# EAGLE design RTI-Dome-eth-ESP32 (EAGLE 9.6.2)

## Sheet 1 of 2
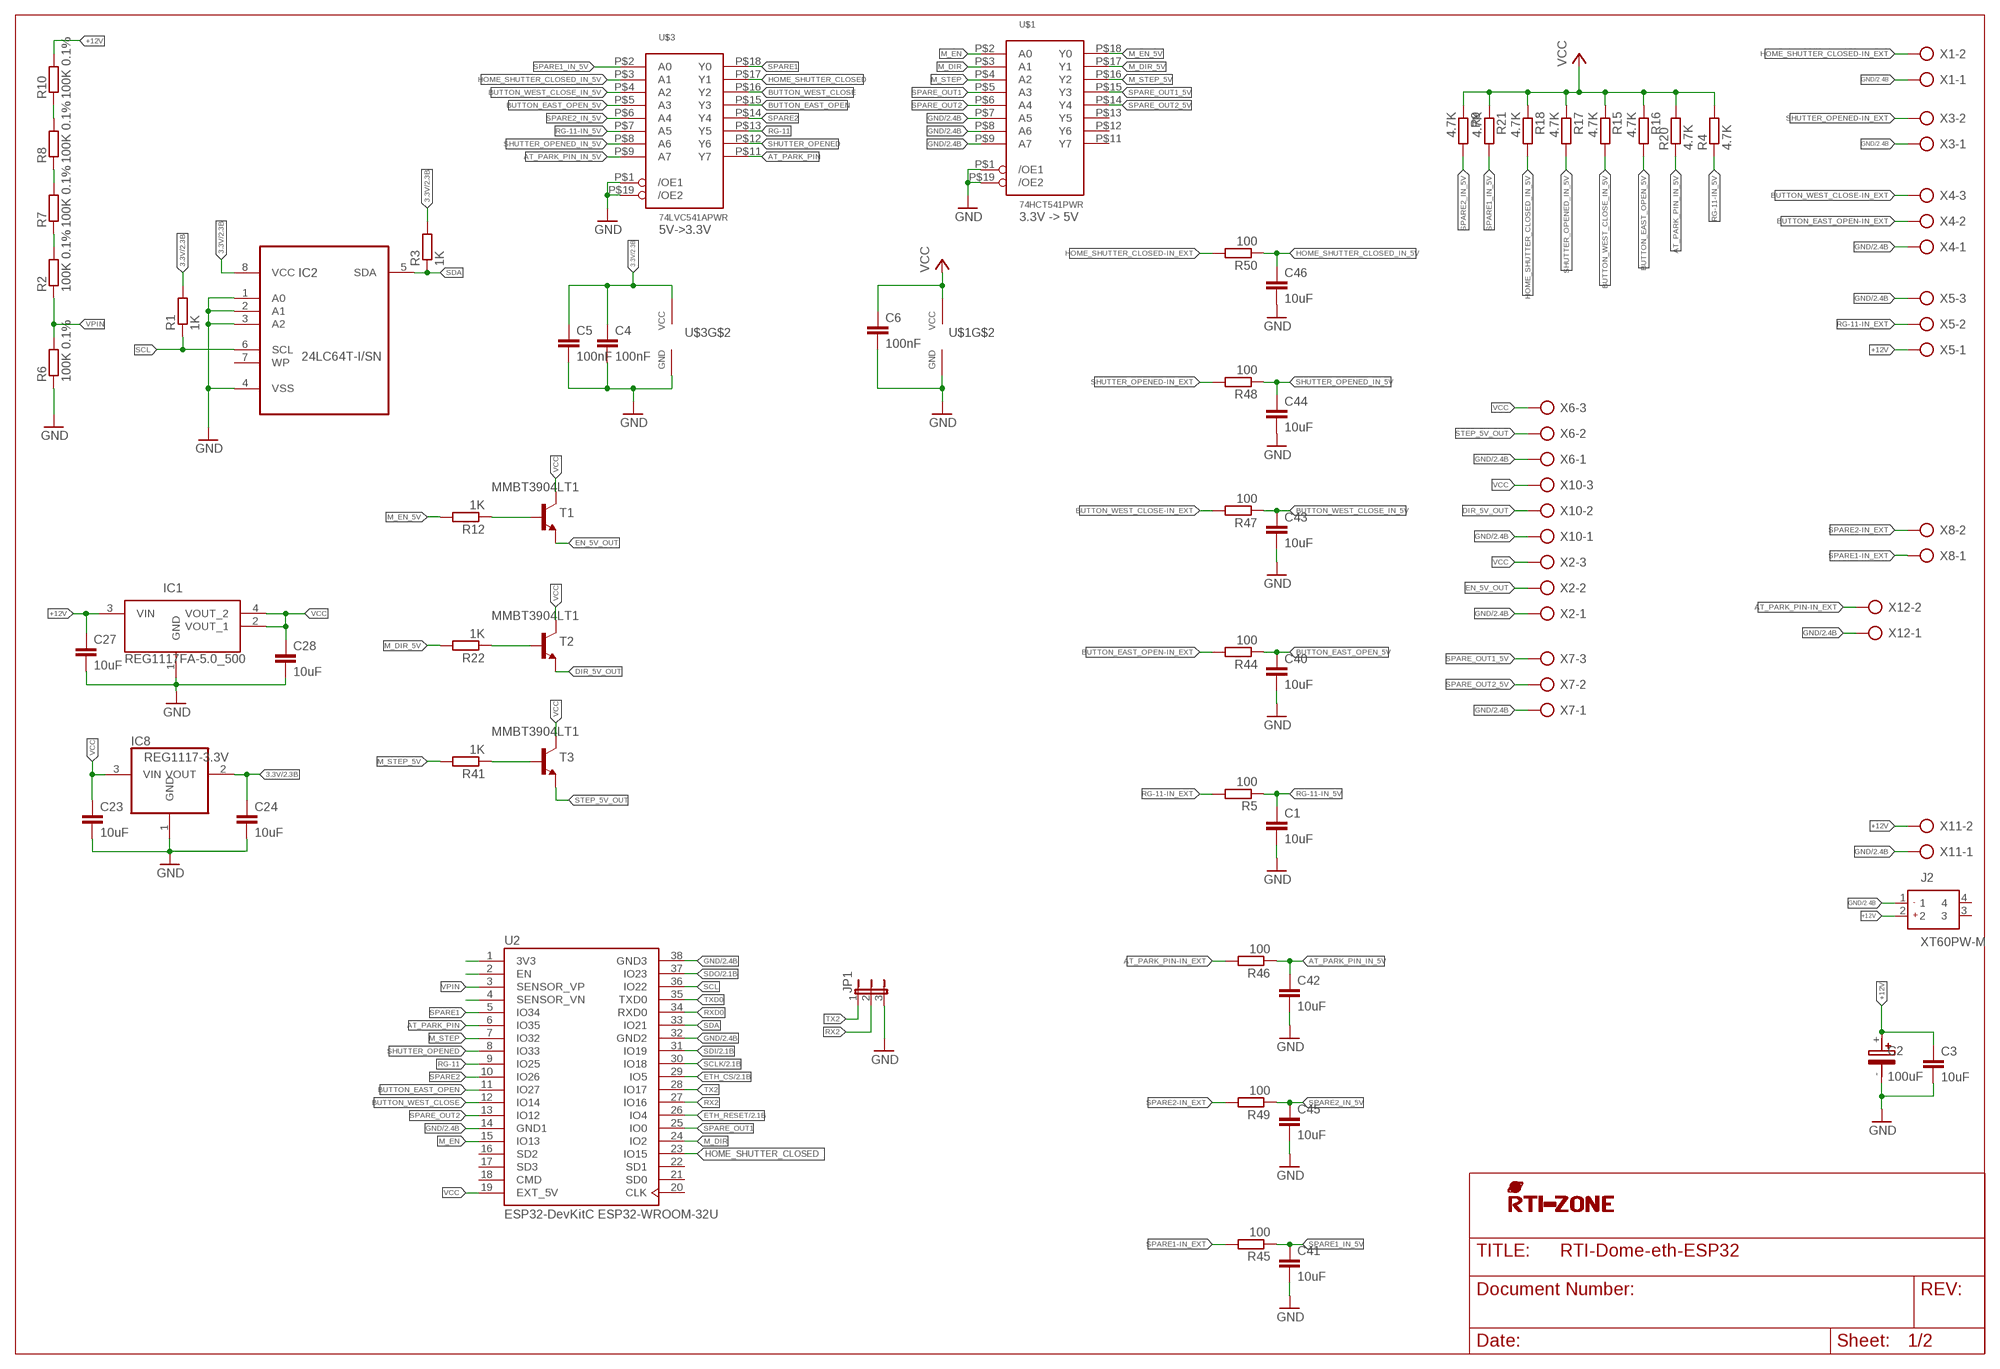
[diagram p0: schematic, sheet 1]

### Parts
C1  10uF  C-EUC0603  [C0603]
C2  100uF  MAL215099804E3""  [UD-10X10_NICHICON]
C3  10uF  C-EUC0603  [C0603]
C4  100nF  C-EUC0603  [C0603]
C5  100nF  C-EUC0603  [C0603]
C6  100nF  C-EUC0603  [C0603]
C23  10uF  C-EUC0603  [C0603]
C24  10uF  C-EUC0603  [C0603]
C27  10uF  C-EUC0603  [C0603]
C28  10uF  C-EUC0603  [C0603]
C40  10uF  C-EUC0603  [C0603]
C41  10uF  C-EUC0603  [C0603]
C42  10uF  C-EUC0603  [C0603]
C43  10uF  C-EUC0603  [C0603]
C44  10uF  C-EUC0603  [C0603]
C45  10uF  C-EUC0603  [C0603]
C46  10uF  C-EUC0603  [C0603]
IC1  REG1117FA-5.0_500  [REG1117FA50500]
IC2  24LC64T-I/SN  [SOIC127P600X175-8N]
IC8  REG1117-3.3V  REG1117  [SOT223]
J2  XT60PW-M  [XT60PWM]
JP1  JP2E  [JP2]
R1  1K  R-EU_R0603  [R0603]
R2  100K 0.1%  R-EU_R0603  [R0603]
R3  1K  R-EU_R0603  [R0603]
R4  4.7K  R-EU_R0603  [R0603]
R5  100  R-EU_R0603  [R0603]
R6  100K 0.1%  R-EU_R0603  [R0603]
R7  100K 0.1%  R-EU_R0603  [R0603]
R8  100K 0.1%  R-EU_R0603  [R0603]
R9  4.7K  R-EU_R0603  [R0603]
R10  100K 0.1%  R-EU_R0603  [R0603]
R12  1K  R-EU_R0603  [R0603]
R15  4.7K  R-EU_R0603  [R0603]
R16  4.7K  R-EU_R0603  [R0603]
R17  4.7K  R-EU_R0603  [R0603]
R18  4.7K  R-EU_R0603  [R0603]
R20  4.7K  R-EU_R0603  [R0603]
R21  4.7K  R-EU_R0603  [R0603]
R22  1K  R-EU_R0603  [R0603]
R41  1K  R-EU_R0603  [R0603]
R44  100  R-EU_R0603  [R0603]
R45  100  R-EU_R0603  [R0603]
R46  100  R-EU_R0603  [R0603]
R47  100  R-EU_R0603  [R0603]
R48  100  R-EU_R0603  [R0603]
R49  100  R-EU_R0603  [R0603]
R50  100  R-EU_R0603  [R0603]
T1  MMBT3904LT1  [SOT23]
T2  MMBT3904LT1  [SOT23]
T3  MMBT3904LT1  [SOT23]
U2  ESP32-DevKitC ESP32-WROOM-32U  ESP32-DEVKITC-32U  [MODULE_ESP32-DEVKITC-32U]
U$1  74HCT541PWR  74541B  [TSSOP20]
U$3  74LVC541APWR  74541B  [TSSOP20]
U$4  RTI-LOGO_BIG  [LOGO_BIG]
X1  AK500/2  [AK500/2]
X2  AK500/3  [AK500/3]
X3  AK500/2  [AK500/2]
X4  AK500/3  [AK500/3]
X5  AK500/3  [AK500/3]
X6  AK500/3  [AK500/3]
X7  AK500/3  [AK500/3]
X8  AK500/2  [AK500/2]
X10  AK500/3  [AK500/3]
X11  AK500/2  [AK500/2]
X12  AK500/2  [AK500/2]

### Nets
3.3V: C4.1 C5.1 C24.1 IC2.8(VCC) IC8.2(VOUT) R1.2 R3.2 U$3.P$20(VCC) ; also sheet 2
+12V [+12V]: C2.+ C3.1 C27.1 IC1.3(VIN) J2.2 R10.2 X5.1 X11.2
AT_PARK_PIN: U2.6(IO35) U$3.P$11(Y7)
AT_PARK_PIN-IN_EXT: R46.2 X12.2
AT_PARK_PIN_IN_5V: C42.1 R20.1 R46.1 U$3.P$9(A7)
BUTTON_EAST_OPEN: U2.11(IO27) U$3.P$15(Y3)
BUTTON_EAST_OPEN-IN_EXT: R44.2 X4.2
BUTTON_EAST_OPEN_5V: C40.1 R16.2 R44.1 U$3.P$5(A3)
BUTTON_WEST_CLOSE: U2.12(IO14) U$3.P$16(Y2)
BUTTON_WEST_CLOSE-IN_EXT: R47.2 X4.3
BUTTON_WEST_CLOSE_IN_5V: C43.1 R15.2 R47.1 U$3.P$4(A2)
DIR-5V_TR: R22.1 T2.1(B)
DIR_5V_OUT: T2.2(E) X10.2
EN-5V_TR: R12.1 T1.1(B)
EN_5V_OUT: T1.2(E) X2.2
ETH_CS: U2.29(IO5) ; also sheet 2
ETH_RESET: U2.26(IO4) ; also sheet 2
GND [GND]: C1.2 C2.- C3.2 C4.2 C5.2 C6.2 C23.2 C24.2 C27.2 C28.2 C40.2 C41.2 C42.2 C43.2 C44.2 C45.2 C46.2 IC1.1(GND) IC2.1(A0) IC2.2(A1) IC2.3(A2) IC2.4(VSS) IC8.1(GND) J2.1 JP1.3 R6.1 U2.14(GND1) U2.32(GND2) U2.38(GND3) U$1.P$1(/OE1) U$1.P$7(A5) U$1.P$8(A6) U$1.P$9(A7) U$1.P$10(GND) U$1.P$19(/OE2) U$3.P$1(/OE1) U$3.P$10(GND) U$3.P$19(/OE2) X1.1 X2.1 X3.1 X4.1 X5.3 X6.1 X7.1 X10.1 X11.1 X12.1 ; also sheet 2
HOME_SHUTTER_CLOSED: U2.23(IO15) U$3.P$17(Y1)
HOME_SHUTTER_CLOSED-IN_EXT: R50.2 X1.2
HOME_SHUTTER_CLOSED_IN_5V: C46.1 R18.2 R50.1 U$3.P$3(A1)
M_DIR: U2.24(IO2) U$1.P$3(A1)
M_DIR_5V: R22.2 U$1.P$17(Y1)
M_EN: U2.15(IO13) U$1.P$2(A0)
M_EN_5V: R12.2 U$1.P$18(Y0)
M_STEP: U2.7(IO32) U$1.P$4(A2)
M_STEP_5V: R41.2 U$1.P$16(Y2)
N$2: R7.2 R8.1
N$3: R8.2 R10.1
N$5: R2.2 R7.1
N$20: U2.1(3V3)
N$21: U2.2(EN)
N$36: U2.4(SENSOR_VN)
RG-11: U2.9(IO25) U$3.P$13(Y5)
RG-11-IN_5V: C1.1 R4.1 R5.1 U$3.P$7(A5)
RG-11-IN_EXT: R5.2 X5.2
RX2: JP1.2 U2.27(IO16)
RXD0: U2.34(RXD0)
SCL: IC2.6(SCL) R1.1 U2.36(IO22)
SCLK: U2.30(IO18) ; also sheet 2
SDA: IC2.5(SDA) R3.1 U2.33(IO21)
SDI: U2.31(IO19) ; also sheet 2
SDO: U2.37(IO23) ; also sheet 2
SHUTTER_OPENED: U2.8(IO33) U$3.P$12(Y6)
SHUTTER_OPENED-IN_EXT: R48.2 X3.2
SHUTTER_OPENED_IN_5V: C44.1 R17.2 R48.1 U$3.P$8(A6)
SPARE1: U2.5(IO34) U$3.P$18(Y0)
SPARE1-IN_EXT: R45.2 X8.1
SPARE1_IN_5V: C41.1 R21.2 R45.1 U$3.P$2(A0)
SPARE2: U2.10(IO26) U$3.P$14(Y4)
SPARE2-IN_EXT [GND]: R49.2 X8.2
SPARE2_IN_5V [GND]: C45.1 R9.2 R49.1 U$3.P$6(A4)
SPARE_OUT1: U2.25(IO0) U$1.P$5(A3)
SPARE_OUT1_5V: U$1.P$15(Y3) X7.3
SPARE_OUT2: U2.13(IO12) U$1.P$6(A4)
SPARE_OUT2_5V: U$1.P$14(Y4) X7.2
STEP-5V_TR: R41.1 T3.1(B)
STEP_5V_OUT: T3.2(E) X6.2
TX2: JP1.1 U2.28(IO17)
TXD0: U2.35(TXD0)
VCC: C6.1 C23.1 C28.1 IC1.2(VOUT_1) IC1.4(VOUT_2) IC8.3(VIN) R4.2 R9.1 R15.1 R16.1 R17.1 R18.1 R20.2 R21.1 T1.3(C) T2.3(C) T3.3(C) U2.19(EXT_5V) U$1.P$20(VCC) X2.3 X6.3 X10.3
VPIN: R2.1 R6.2 U2.3(SENSOR_VP)
Unconnected: IC2.7(WP) J2.3 J2.4 U2.16(SD2) U2.17(SD3) U2.18(CMD) U2.20(CLK) U2.21(SD0) U2.22(SD1) U$1.P$11(Y7) U$1.P$12(Y6) U$1.P$13(Y5)

### Notes on the sheet
- 3.3V -> 5V
- 5V->3.3V

## Sheet 2 of 2
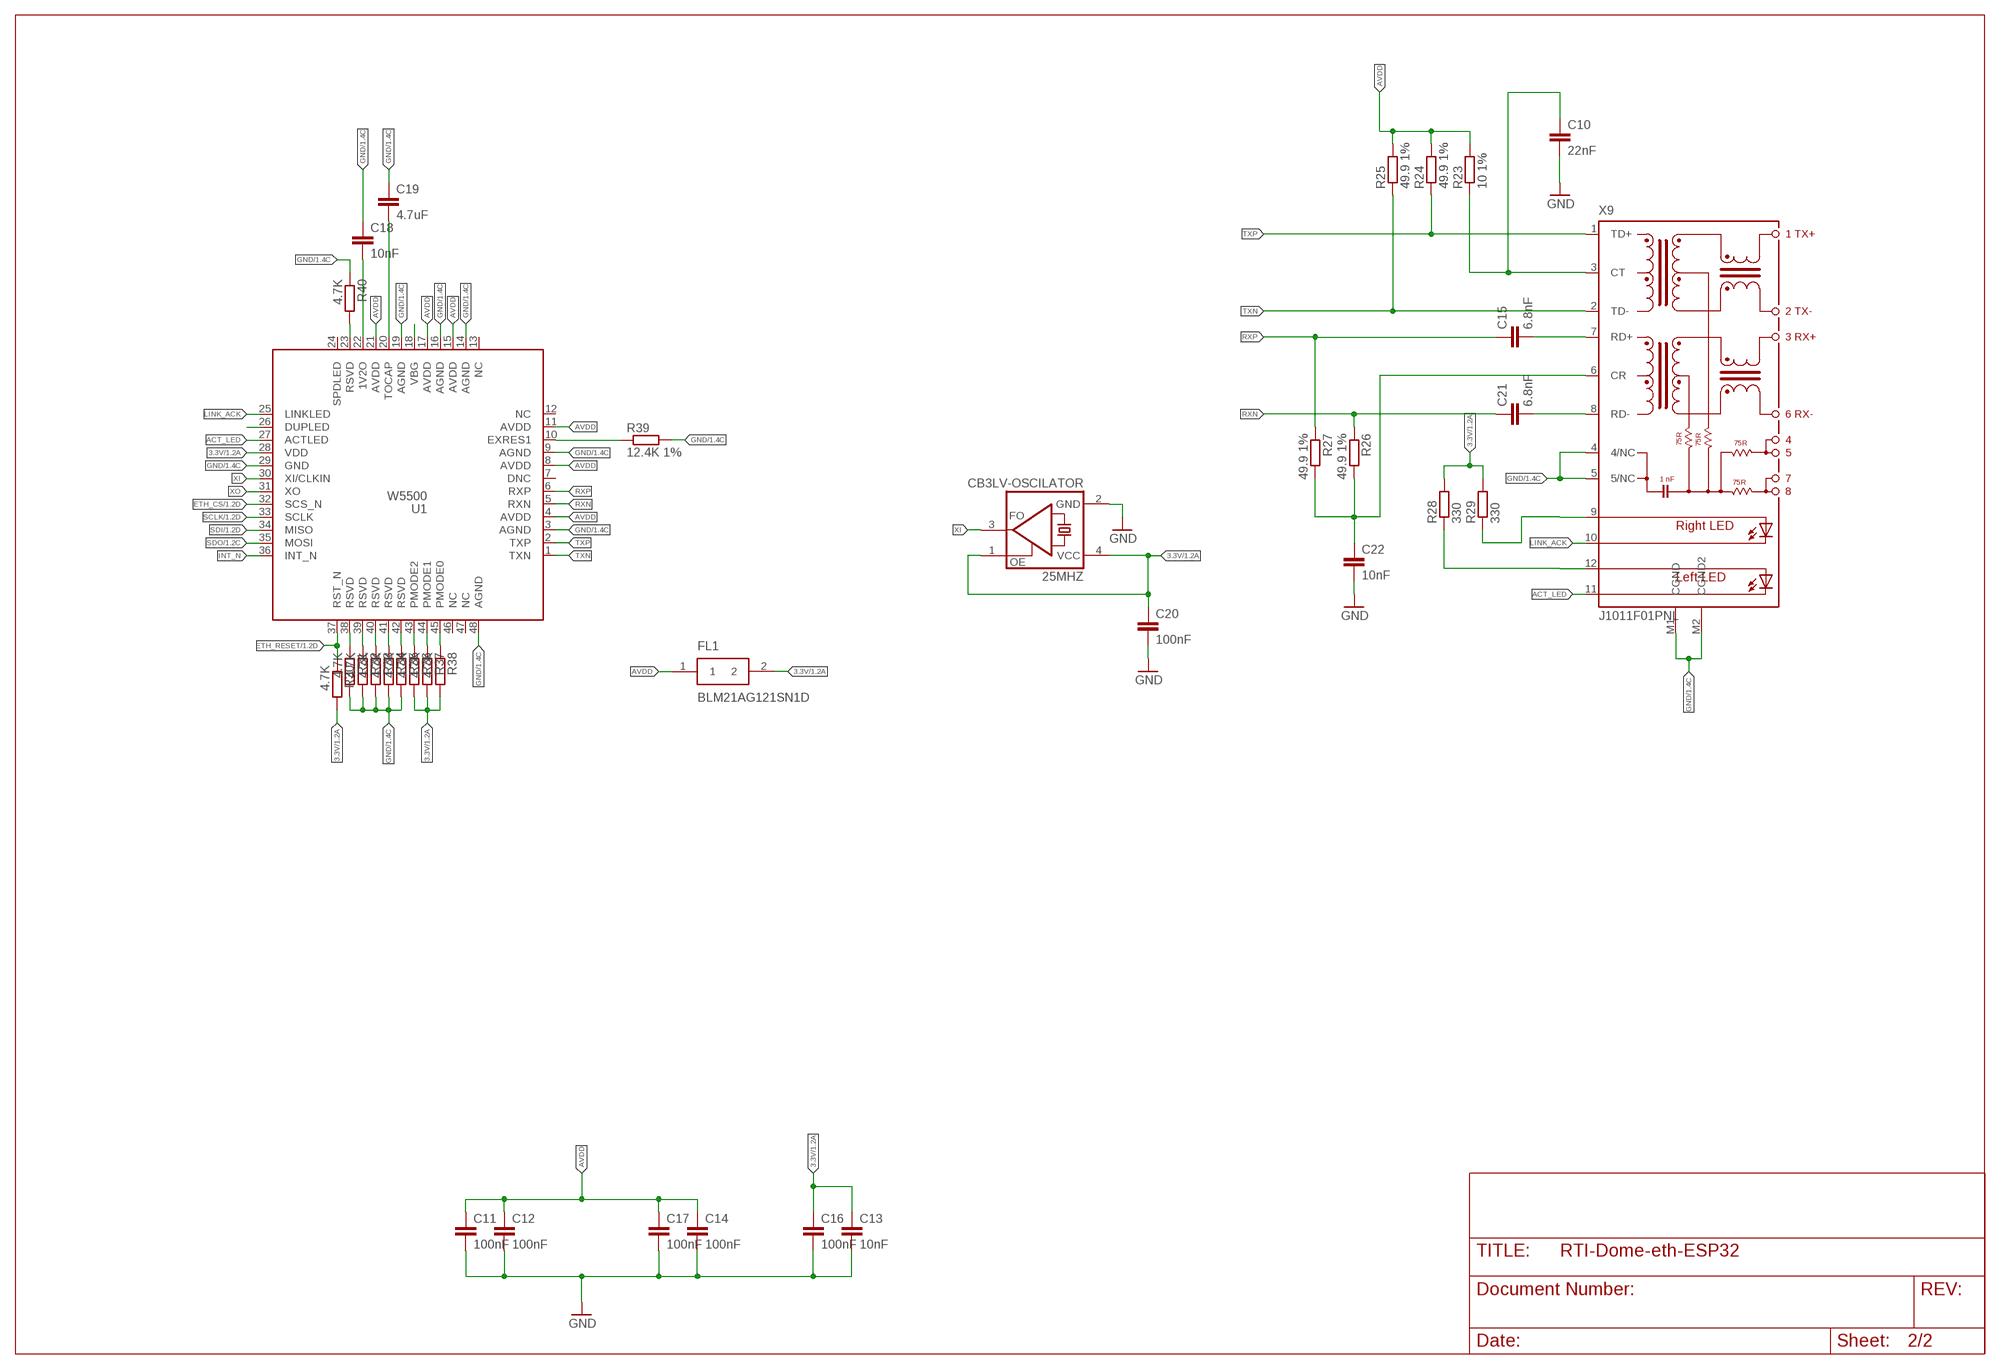
[diagram p1: schematic, sheet 2]

### Parts
25MHZ  CB3LV-OSCILATOR  [SMD-7050_4P]
C10  22nF  C-EUC0603  [C0603]
C11  100nF  C-EUC0603  [C0603]
C12  100nF  C-EUC0603  [C0603]
C13  10nF  C-EUC0603  [C0603]
C14  100nF  C-EUC0603  [C0603]
C15  6.8nF  C-EUC0603  [C0603]
C16  100nF  C-EUC0603  [C0603]
C17  100nF  C-EUC0603  [C0603]
C18  10nF  C-EUC0603  [C0603]
C19  4.7uF  C-EUC0603  [C0603]
C20  100nF  C-EUC0603  [C0603]
C21  6.8nF  C-EUC0603  [C0603]
C22  10nF  C-EUC0603  [C0603]
FL1  BLM21AG121SN1D  [L0805]
R23  10 1%  R-EU_R0603  [R0603]
R24  49.9 1%  R-EU_R0603  [R0603]
R25  49.9 1%  R-EU_R0603  [R0603]
R26  49.9 1%  R-EU_R0603  [R0603]
R27  49.9 1%  R-EU_R0603  [R0603]
R28  330  R-EU_R0603  [R0603]
R29  330  R-EU_R0603  [R0603]
R30  4.7K  R-EU_R0603  [R0603]
R31  4.7K  R-EU_R0603  [R0603]
R32  4.7K  R-EU_R0603  [R0603]
R33  4.7K  R-EU_R0603  [R0603]
R34  4.7K  R-EU_R0603  [R0603]
R35  4.7K  R-EU_R0603  [R0603]
R36  4.7K  R-EU_R0603  [R0603]
R37  4.7K  R-EU_R0603  [R0603]
R38  4.7K  R-EU_R0603  [R0603]
R39  12.4K 1%  R-EU_R0603  [R0603]
R40  4.7K  R-EU_R0603  [R0603]
U1  W5500  [LQFP48]
X9  J1011F01PNL  [J1011F01PNL]

### Nets
3.3V: 25MHZ.1(OE) 25MHZ.4(VDD) C13.1 C16.1 C20.1 FL1.2 R28.2 R29.2 R30.2 R36.2 R37.2 R38.2 U1.28(VDD) ; also sheet 1
ACT_LED: U1.27(ACTLED) X9.11(C-L)
AVDD: C11.1 C12.1 C14.1 C17.1 FL1.1 R23.2 R24.2 R25.2 U1.4(AVDD) U1.8(AVDD) U1.11(AVDD) U1.15(AVDD) U1.17(AVDD) U1.21(AVDD)
ETH_CS: U1.32(SCS_N) ; also sheet 1
ETH_RESET: R30.1 U1.37(RST_N) ; also sheet 1
GND [GND]: 25MHZ.2(GND) C10.2 C11.2 C12.2 C13.2 C14.2 C16.2 C17.2 C18.1 C19.1 C20.2 C22.2 R31.2 R32.2 R33.2 R34.2 R35.2 R39.2 R40.1 U1.3(AGND) U1.9(AGND) U1.14(AGND) U1.16(AGND) U1.19(AGND) U1.29(GND) U1.48(AGND) X9.4(4/NC) X9.5(5/NC) X9.M1(CGND) X9.M2(CGND2) ; also sheet 1
INT_N: U1.36(INT_N)
LINK_ACK: U1.25(LINKLED) X9.10(C-R)
N$7 [+3V3]: C22.1 R26.2 R27.2 X9.6(CR)
N$8: R29.1 X9.9(A-R)
N$10: R28.1 X9.12(AL)
N$11: C15.2 X9.7(RD+)
N$12: C21.2 X9.8(RD-)
N$13 [+3V3]: C10.1 R23.1 X9.3(CT)
N$17: U1.26(DUPLED)
N$22: R31.1 U1.38(RSVD)
N$23: R32.1 U1.39(RSVD)
N$24: R33.1 U1.40(RSVD)
N$25: R34.1 U1.41(RSVD)
N$26: R35.1 U1.42(RSVD)
N$27: R36.1 U1.43(PMODE2)
N$28: R37.1 U1.44(PMODE1)
N$29: R38.1 U1.45(PMODE0)
N$31: C19.2 U1.20(TOCAP)
N$32: U1.18(VBG)
N$33: C18.2 U1.22(1V2O)
N$34: R39.1 U1.10(EXRES1)
N$35: R40.2 U1.23(RSVD)
RXN: C21.1 R26.1 U1.5(RXN)
RXP: C15.1 R27.1 U1.6(RXP)
SCLK: U1.33(SCLK) ; also sheet 1
SDI: U1.34(MISO) ; also sheet 1
SDO: U1.35(MOSI) ; also sheet 1
TXN [diff]: R25.1 U1.1(TXN) X9.2(TD-)
TXP: R24.1 U1.2(TXP) X9.1(TD+)
XI: 25MHZ.3(FO) U1.30(XI/CLKIN)
XO: U1.31(XO)
Unconnected: U1.7(DNC) U1.12(NC) U1.13(NC) U1.24(SPDLED) U1.46(NC) U1.47(NC)

## Library data of the parts
25MHZ = rti:CB3LV-OSCILATOR; MPN: CB3LV-3I-25M0000
C1 C3 C23 C24 C27 C28 C40-C46 = rcl:C-EU: CAPACITOR, European symbol; MPN: CC0805KKX5R8BB106; SPICEPREFIX: C
C2 = samacsys:MAL215099804E3: Aluminum Electrolytic Capacitors - SMD 100uF 63V 20% Source: Datasheet <https://www.vishay.com/docs/28395/150crz.pdf>; MPN: MAL215099804E3
C4-C6 C11 C12 C14 C16 C17 C20 = rcl:C-EU: CAPACITOR, European symbol; MPN: 0805YD104KAT2A; SPICEPREFIX: C
C10 = rcl:C-EU: CAPACITOR, European symbol; MPN: CC0805JRX7R8BB223; SPICEPREFIX: C
C13 C18 C22 = rcl:C-EU: CAPACITOR, European symbol; MPN: CC0805KRX7R9BB103; SPICEPREFIX: C
C15 C21 = rcl:C-EU: CAPACITOR, European symbol; MPN: C0805C682F4HACTU; SPICEPREFIX: C
C19 = rcl:C-EU: CAPACITOR, European symbol; MPN: C0805C475J3RACTU; SPICEPREFIX: C
FL1 = BLM21AG121SN1D:BLM21AG121SN1D: BLM21_N1D Series EMI Suppression Filter 120+/-25% at 100MHz 1A @85 Source: Datasheet <https://www.murata.com/en-us/products/productdetail?partno=BLM21AG121SN1#>; MPN: BLM21AG121SN1D
IC1 = REG1117FA-5.0_500:REG1117FA-5.0_500: 800mA and 1A Low Dropout Positive Regulator 1.8V, 2.5V, 2.85, 3.3V, 5V, and Adjustable Source: Datasheet <https://www.ti.com/lit/ds/symlink/reg1117a.pdf?ts=1712806080445>; ARROW_PART_NUMBER: REG1117FA-5.0/500; ARROW_PRICE-STOCK: https://www.arrow.com/en/products/reg1117fa-5.0500/texas-instruments?region=nac; DESCRIPTION: 800mA and 1A Low Dropout Positive Regulator 1.8V, 2.5V, 2.85, 3.3V, 5V, and Adjustable; HEIGHT: 5.08mm; MANUFACTURER_NAME: Texas Instruments; MANUFACTURER_PART_NUMBER: REG1117FA-5.0/500; MOUSER_PART_NUMBER: 595-REG1117FA50/500; MOUSER_PRICE-STOCK: https://www.mouser.co.uk/ProductDetail/Texas-Instruments/REG1117FA-5.0-500?qs=PVVDbbWpW3KD0gSKmem36g%3D%3D
IC2 = Microchip_By_element14_Batch_1:24LC64T-I/SN: 64K I2C Serial EEPROM; MPN: 24LC64T-I/SN; OC_FARNELL: 1296583; OC_NEWARK: 12C2021; PACKAGE: SOIC-8; SUPPLIER: MICROCHIP
IC8 = burr-brown:REG1117: 800mA and 1A Low Dropout (LDO) Positive Regulator 1.8V, 2.5V, 2.85V, 3.3V, 5V, and Adj; MPN: REG1117-3.3/2K5; OC_FARNELL: 1097566; OC_NEWARK: 14P6981
J2 = samacsys:XT60PW-M: Socket; DC supply; XT60; male; PIN: 2; on PCBs; THT; Colour: yellow Source: Datasheet <https://www.tme.eu/Document/9b8d0c5eb7094295f3d3112c214d3ade/XT60PW SPEC.pdf>; DESCRIPTION: Socket; DC supply; XT60; male; PIN: 2; on PCBs; THT; Colour: yellow; HEIGHT: 8.4mm; MANUFACTURER_NAME: Changzou Amass Elec; MANUFACTURER_PART_NUMBER: XT60PW-M; MPN: XT60PW-M
JP1 = rti:JP2E: JUMPER
R1 R3 = rcl:R-EU_: RESISTOR, European symbol; MPN: RT0805FRE071KL; SPICEPREFIX: R
R2 R6-R8 R10 = rcl:R-EU_: RESISTOR, European symbol; MPN: AT0805BRD07100KL; SPICEPREFIX: R
R4 R9 R12 R15-R18 R20-R22 R30-R38 R40 R41 = rcl:R-EU_: RESISTOR, European symbol; MPN: RT0805FRE074K7L; SPICEPREFIX: R
R5 R44-R50 = rcl:R-EU_: RESISTOR, European symbol; MPN: RT0805FRD07100RL; SPICEPREFIX: R
R23 = rcl:R-EU_: RESISTOR, European symbol; MPN: RT0805FRE1310RL; SPICEPREFIX: R
R24-R27 = rcl:R-EU_: RESISTOR, European symbol; MPN: RC0805FR-0749R9L; SPICEPREFIX: R
R28 R29 = rcl:R-EU_: RESISTOR, European symbol; MPN: RC0805JR-07330RL; SPICEPREFIX: R
R39 = rcl:R-EU_: RESISTOR, European symbol; MPN: RC0805FR-0712K4L; SPICEPREFIX: R
T1-T3 = samacsys:MMBT3904LT1: NPN TRANSISTOR
U1 = W5500:W5500; MPN: W5500
U2 = ESP32-DEVKITC-32D:ESP32-DEVKITC-32: Check availability <https://pricing.snapeda.com/parts/ESP32-DEVKITC-32D/Espressif%20Systems/view-part?ref=eda>
U$1 U$3 = rti:74*541: Octal non inverting buffer
U$4 = rti:RTI-LOGO
X1 X3 X8 X11 X12 = rti:AK500/2: CONNECTOR; MPN: 691101710002; OC_FARNELL: unknown; OC_NEWARK: unknown
X2 X6 X7 X10 = rti:AK500/3: CONNECTOR; OC_FARNELL: unknown; OC_NEWARK: unknown
X4 X5 = rti:AK500/3: CONNECTOR; MPN: 691101710003; OC_FARNELL: unknown; OC_NEWARK: unknown
X9 = rti:J1011F01PNL: PULSEJACK (TM) 1x1 Tab-UP RJ45 10/100 Base-TX RJ45 1x1 Tab-UP with LEDs 8-pin (J1 series) and 6-pin (JP series) integrated magnetics connector, designed to support applications, such as ADSL modems, LAN-on-Motherboard, and Hub and Switches. Source: www.pulseeng.com .. PulseJack-J402.pdf

## Net classes
0 default: width 0.254 mm, drill 0.3 mm, clearance 0.152 mm
1 +12V: width 0.254 mm, drill 0.3 mm, clearance 0.152 mm
2 GND: width 0.254 mm, drill 0.3 mm, clearance 0.152 mm
3 +3V3: width 0.254 mm, drill 0.254 mm, clearance 0.152 mm
4 diff: width 0.254 mm, drill 0.254 mm, clearance 0.152 mm

## Board
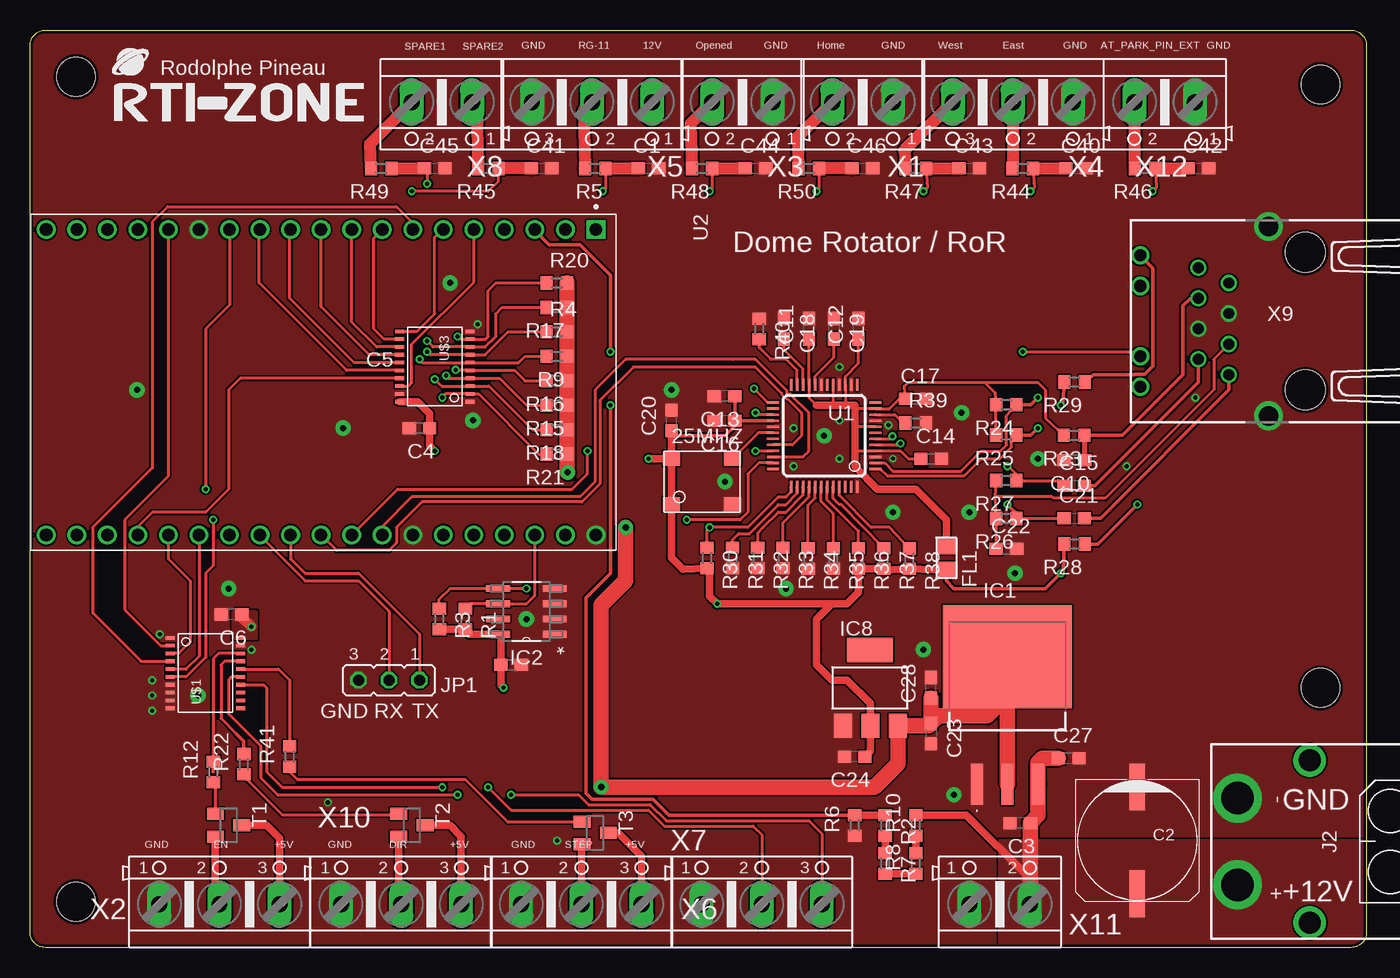
[diagram p2: board, top side]
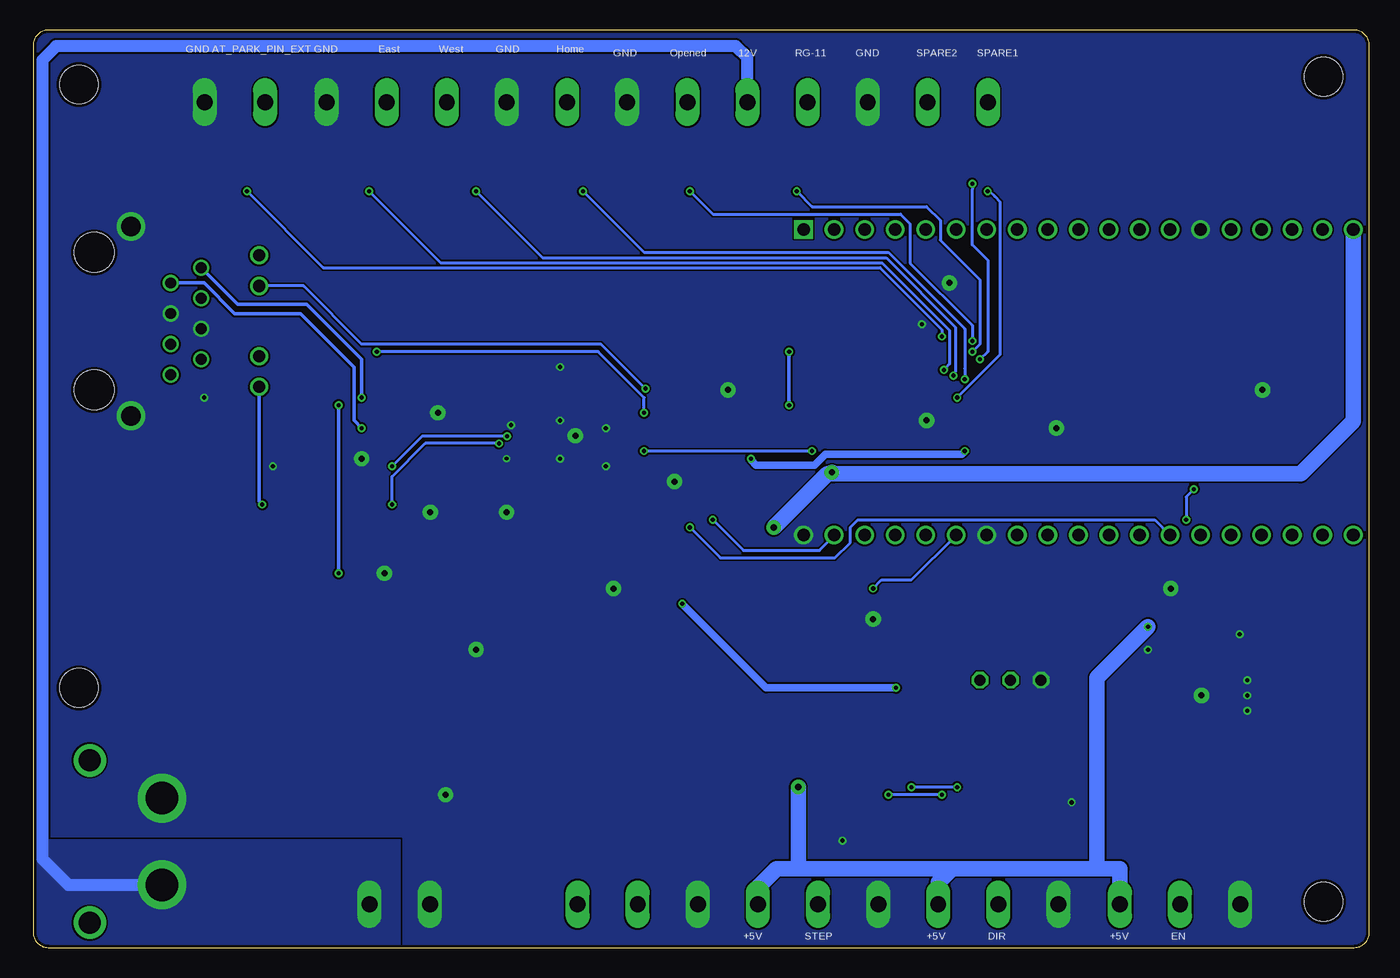
[diagram p3: board, bottom side, seen from below]

Size 111.13 x 76.27 mm. Coordinates in mm from the lower left corner, seen from the top.
Outline: 0,75.01 arc-90 1.26,76.27 109.87,76.27 arc-90 111.13,75.01 111.13,1.26 arc-90 109.87,0 1.26,0 arc-90 0,1.26 0,75.01
Copper layers (1*16): Top 0.089mm / dielectric 1.442mm / Bottom 0.089mm
Design rules "jlcpcb2layer *": minimum track width 5mil, minimum drill 0.2mm, track to track 5mil, track to pad 5mil, pad to pad 5mil, via to via 5mil, smd to smd 5mil, copper to edge 10mil, drill to drill 0.5mm, minimum pad ring 6mil, minimum via ring 6mil, stop-mask expansion 0.05mm, vias tented up to drill 130mil, thermal gap 8mil
Holes 3.2 mm at 107.31,71.75 107.31,21.59 3.81,3.81 3.81,72.39

### Footprints (pad centres in the part's own frame; a part is rotated, then mirrored left to right if it is on the bottom)
SMD-7050_4P = smd 1.397 x 1.194: 1 -2.54,-1.27; 2 2.54,-1.27; 3 2.54,2.54; 4 -2.54,2.54
C0603 = smd 1.1 x 1: 1 -0.85,0; 2 0.85,0
UD-10X10_NICHICON = smd 3.9 x 1.3: + 4.433,0; - -4.458,0
L0805 = smd 1.3 x 1.5: 1 -0.95,0; 2 0.95,0
REG1117FA50500 = smd 1 x 3.4: 1 -2.54,-6.745; 2 0,-6.745; 3 2.54,-6.745 | smd 10.7 x 8.6: 4 0,3.855
SOIC127P600X175-8N = smd 1.981 x 0.559: 1 -2.362,1.905; 2 -2.362,0.635; 3 -2.362,-0.635; 4 -2.362,-1.905; 5 2.362,-1.905; 6 2.362,-0.635; 7 2.362,0.635; 8 2.362,1.905
SOT223 = smd 1.499 x 2.007: 1 -2.261,-3.15; 2 0.025,-3.15; 3 2.311,-3.15 | smd 3.81 x 2.007: 4 0,3.15
XT60PWM = drill 2.7 pad 4.05: 1 -3.6,0; 2 3.6,0 | drill 1.8 pad 2.7: 3 6.75,6; 4 -6.75,6
JP2 = drill 0.914 octagon: 1 -2.54,0; 2 0,0; 3 2.54,0
R0603 = smd 1 x 1.1: 1 -0.85,0; 2 0.85,0
SOT23 = smd 1 x 1.4: 1 -0.95,-1.1; 2 0.95,-1.1; 3 0,1.1
LQFP48 = smd 1 x 0.2: 1 -4.25,2.75; 2 -4.25,2.25; 3 -4.25,1.75; 4 -4.25,1.25; 5 -4.25,0.75; 6 -4.25,0.25; 7 -4.25,-0.25; 8 -4.25,-0.75; 9 -4.25,-1.25; 10 -4.25,-1.75; 11 -4.25,-2.25; 12 -4.25,-2.75; 25 4.25,-2.75; 26 4.25,-2.25; 27 4.25,-1.75; 28 4.25,-1.25; 29 4.25,-0.75; 30 4.25,-0.25; 31 4.25,0.25; 32 4.25,0.75; 33 4.25,1.25; 34 4.25,1.75; 35 4.25,2.25; 36 4.25,2.75 | smd 0.2 x 1: 13 -2.75,-4.25; 14 -2.25,-4.25; 15 -1.75,-4.25; 16 -1.25,-4.25; 17 -0.75,-4.25; 18 -0.25,-4.25; 19 0.25,-4.25; 20 0.75,-4.25; 21 1.25,-4.25; 22 1.75,-4.25; 23 2.25,-4.25; 24 2.75,-4.25; 37 2.75,4.25; 38 2.25,4.25; 39 1.75,4.25; 40 1.25,4.25; 41 0.75,4.25; 42 0.25,4.25; 43 -0.25,4.25; 44 -0.75,4.25; 45 -1.25,4.25; 46 -1.75,4.25; 47 -2.25,4.25; 48 -2.75,4.25
MODULE_ESP32-DEVKITC-32U = drill 1.04 square: 1 -12.7,19.76 | drill 1.04: 2 -12.7,17.22; 3 -12.7,14.68; 4 -12.7,12.14; 5 -12.7,9.6; 6 -12.7,7.06; 7 -12.7,4.52; 8 -12.7,1.98; 9 -12.7,-0.56; 10 -12.7,-3.1; 11 -12.7,-5.64; 12 -12.7,-8.18; 13 -12.7,-10.72; 14 -12.7,-13.26; 15 -12.7,-15.8; 16 -12.7,-18.34; 17 -12.7,-20.88; 18 -12.7,-23.42; 19 -12.7,-25.96; 20 12.7,-25.96; 21 12.7,-23.42; 22 12.7,-20.88; 23 12.7,-18.34; 24 12.7,-15.8; 25 12.7,-13.26; 26 12.7,-10.72; 27 12.7,-8.18; 28 12.7,-5.64; 29 12.7,-3.1; 30 12.7,-0.56; 31 12.7,1.98; 32 12.7,4.52; 33 12.7,7.06; 34 12.7,9.6; 35 12.7,12.14; 36 12.7,14.68; 37 12.7,17.22; 38 12.7,19.76
TSSOP20 = smd 0.75 x 0.3: P$1 -2.94,2.885; P$2 -2.94,2.235; P$3 -2.94,1.585; P$4 -2.94,0.935; P$5 -2.94,0.285; P$6 -2.94,-0.365; P$7 -2.94,-1.015; P$8 -2.94,-1.665; P$9 -2.94,-2.315; P$10 -2.94,-2.965; P$11 2.91,-2.965; P$12 2.91,-2.315; P$13 2.91,-1.665; P$14 2.91,-1.015; P$15 2.91,-0.365; P$16 2.91,0.285; P$17 2.91,0.935; P$18 2.91,1.585; P$19 2.91,2.235; P$20 2.91,2.885
AK500/2 = drill 1.321 long: 1 -2.515,0; 2 2.515,0
AK500/3 = drill 1.321 long: 1 -5.004,0; 2 0,0; 3 5.004,0
J1011F01PNL = drill 0.9 pad 1.3: 1 4.445,2.54; 2 3.175,0; 3 1.905,2.54; 4 0.635,0; 5 -0.635,2.54; 6 -1.905,0; 7 -3.175,2.54; 8 -4.445,0 | drill 1 pad 1.422: 9 5.465,7.37; 10 2.925,7.37; 11 -2.925,7.37; 12 -5.465,7.37 | drill 1.6 pad 2.184: M1 -7.875,-3.3; M2 7.875,-3.3 | hole 3.3: 5.715,-6.35; -5.715,-6.35

### Placement (x,y rotation side)
25MHZ  55.88,38.1 0 top
C1  51.44,64.77 0 top
C2  92.08,8.89 270 top
C3  82.33,10.35 180 top
C4  32.38,43.18 180 top
C5  40.01,23.5 0 top
C6  16.76,27.69 180 top
C10  86.84,40.51 180 top
C11  64.77,51.44 90 top
C12  68.9,51.44 90 top
C13  57.75,45.85 180 top
C14  74.93,40.64 0 top
C15  86.83,38.41 0 top
C16  57.75,43.78 180 top
C17  73.66,45.64 0 top
C18  62.71,51.44 270 top
C19  66.83,51.44 270 top
C20  53.34,43.81 90 top
C21  86.83,35.69 0 top
C22  81.19,33.15 0 top
C23  74.93,17.78 270 top
C24  68.58,15.88 180 top
C27  86.36,15.75 0 top
C28  74.93,21.59 90 top
C40  87,64.77 0 top
C41  42.55,64.77 0 top
C42  97.16,64.77 0 top
C43  78.11,64.77 0 top
C44  60.33,64.77 0 top
C45  33.66,64.77 0 top
C46  69.22,64.77 0 top
FL1  76.2,32.38 270 top
IC1  81.28,20.32 0 top
IC2  41.27,27.94 180 top
IC8  69.85,21.59 0 top
J2  100.42,8.81 270 top
JP1  29.84,22.23 180 top
R1  36.2,27.3 270 top
R2  71.12,10.16 270 top
R3  34.04,27.3 270 top
R4  43.81,51.18 0 top
R5  46.99,64.77 180 top
R6  68.58,10.16 90 top
R7  71.12,6.99 270 top
R8  73.66,6.99 90 top
R9  43.81,49.15 180 top
R10  73.66,10.16 90 top
R12  15.24,14.61 90 top
R15  43.81,45.09 180 top
R16  43.81,47.12 180 top
R17  43.81,53.21 180 top
R18  43.81,43.05 180 top
R20  43.81,55.24 0 top
R21  43.81,41.02 180 top
R22  17.78,15.24 90 top
R23  86.84,42.58 180 top
R24  81.19,45.12 180 top
R25  81.19,42.6 180 top
R26  81.19,35.66 180 top
R27  81.19,38.82 180 top
R28  86.86,33.54 180 top
R29  86.86,47.01 180 top
R30  56.29,32.38 270 top
R31  58.42,32.38 270 top
R32  60.52,32.38 270 top
R33  62.61,32.38 270 top
R34  64.71,32.35 270 top
R35  66.8,32.35 270 top
R36  68.9,32.35 270 top
R37  70.99,32.35 270 top
R38  73.12,32.32 270 top
R39  73.66,43.6 0 top
R40  60.64,51.44 270 top
R41  21.59,15.88 90 top
R44  82.55,64.77 180 top
R45  38.1,64.77 180 top
R46  92.71,64.77 180 top
R47  73.66,64.77 180 top
R48  55.88,64.77 180 top
R49  29.21,64.77 180 top
R50  64.77,64.77 180 top
T1  16.51,10.16 270 top
T2  31.75,10.16 270 top
T3  46.99,9.53 270 top
U1  66.04,42.55 180 top
U2  27.3,46.99 270 top
U$1  14.61,22.86 0 top
U$3  33.66,48.26 180 top
U$4  6.99,68.71 0 top
X1  69.24,70.28 180 top
X2  15.75,3.6 0 top
X3  59.24,70.28 180 top
X4  81.73,70.28 180 top
X5  46.73,70.28 180 top
X6  45.85,3.6 0 top
X7  60.85,3.6 0 top
X8  34.24,70.28 180 top
X9  99.69,52.07 90 top
X10  30.86,3.6 0 top
X11  80.64,3.6 0 top
X12  94.36,70.28 180 top

### Tracks (layer width: path | path; a pad name or v marks a point on that pad's centre or on a via)
3.3V  (via drill 0.35)
  Top 0.254: FL1.2 76.14,31.38 76.14,31.37
  Top 0.305: C20.1 53.66,42.55 57.78,42.55 58.7,43.46 C16.1 | C16.1 C13.1 | U1.28 58.72,43.8 C16.1 | R29.2 85.91,45.27 v85.72,45.09 | R28.2 85.92,31.3 v85.72,31.11 84.45,29.84 76.83,29.84 76.2,30.48 FL1.2
  Top 0.61: 66.67,28.57 67.94,28.57 68.9,29.53 R36.2 R37.2 71.03,31.37 R38.2 76.14,31.37 | 66.67,28.57 65.41,27.3 65.41,24.77 65.41,23.5 66.67,22.23 67.94,22.23 69.88,20.3 IC8.2 69.88,16.32 C24.1 | 66.67,28.57 v57.15,28.57 56.52,29.21 56.52,31.21 R30.2 54.29,31.43 53.34,32.38 25MHZ.1 25MHZ.4 | C20.1 25MHZ.4 | R3.2 R1.2 36.52,26.04 IC2.8 39.16,25.79 C5.1 39.16,21.8 v39.37,21.59 | U$3.P$20 32.22,45.38 33.23,44.36 C4.1 33.23,41.7 v33.66,41.27 | v51.44,40.64 25MHZ.4
  Bottom 0.305: v85.72,45.09 v85.72,31.11
  Bottom 0.61: v33.66,41.27 33.91,41.02 45.24,41.02 46.16,40.11 51,40.11 51.4,40.51 51.4,40.61 v51.44,40.64 | v39.37,21.59 50.16,21.59 v57.15,28.57
+12V
  Top 0.61: R10.2 77.88,11.01 83.18,5.71
  Top 1.27: X11.2 83.18,3.62 83.18,5.71 83.18,8.26 C3.1 83.82,10.99 IC1.3 83.82,15.37 84.2,15.75 C27.1
  Bottom 1.016: X5.1 51.73,73.96 52.7,74.93 109.22,74.93 110.37,73.78 110.37,7.37 108.2,5.21 J2.2
  pour Top (isolate 0.122, no thermals): 80.64,8.89 111.12,8.89 111.12,0 80.64,0
  pour Bottom (isolate 0.122, no thermals): 80.64,8.89 111.12,8.89 111.12,0 80.64,0
ACT_LED  (via drill 0.35)
  Top 0.254: U1.27 60.48,44.3 v60.33,44.45 | v82.55,49.53 91.94,49.53 X9.11
  Bottom 0.254: v60.33,44.45 60.33,45.72 64.14,49.53 v82.55,49.53
AT_PARK_PIN
  Top 0.254: U$3.P$11 32.17,51.23 33.66,52.7 33.66,59.05 34.29,59.69 U2.6
AT_PARK_PIN-IN_EXT
  Top 1.016: R46.2 91.85,64.86 X12.2
AT_PARK_PIN_IN_5V  (via drill 0.35)
  Top 0.254: R46.1 93.66,63.18 v93.34,62.87 | R20.1 38.73,55.24 38.1,54.61 38.1,50.8 37.88,50.58 U$3.P$9 35.78,50.58 v35.56,50.8
  Top 1.016: R46.1 C42.1
  Bottom 0.254: v93.34,62.87 87,56.52 40.71,56.52 35.56,51.37 v35.56,50.8
AVDD
  Top 0.254: C11.1 64.79,50.47 U1.21 64.79,45.7 65.41,45.09 | C12.1 68.9,48.58 67.79,47.47 U1.15 67.79,45.24 67.94,45.09 | 68.58,45.09 68.87,44.8 U1.11 71.47,44.8 72.31,45.64 72.47,45.64 C17.1 72.71,46.67 73.03,46.99 79.38,46.99 | U1.8 68.69,43.3 68.58,43.18 | C14.1 73.03,40.64 72.37,41.3 U1.4 70.27,41.27 68.58,41.27 | U1.17 66.79,45.2 66.67,45.09 | R25.2 R24.2 80.24,46.12 79.38,46.99 | 79.38,46.99 83.82,46.99 84.45,46.35 84.45,44.01 R23.2
  Top 0.61: 65.41,45.09 66.67,45.09 67.94,45.09 68.58,45.09 68.58,43.18 68.58,41.27 68.58,40.01 70.48,38.1 73.66,38.1 76.2,35.56 FL1.1
BUTTON_EAST_OPEN
  Top 0.254: U$3.P$15 26.94,48.62 21.59,53.98 21.59,59.62 U2.11
BUTTON_EAST_OPEN-IN_EXT
  Top 1.016: X4.2 81.73,64.9 R44.2
BUTTON_EAST_OPEN_5V  (via drill 0.35)
  Top 0.254: R44.1 83.5,63.18 v83.19,62.87 | R16.2 41.15,47.12 40.29,47.98 U$3.P$5 35.43,47.98 v35.39,48.02
  Top 1.016: R44.1 C40.1
  Bottom 0.254: v83.19,62.87 77.24,56.92 40.54,56.92 34.92,51.31 34.92,48.51 35.26,48.18 35.26,48.15 v35.39,48.02
BUTTON_WEST_CLOSE
  Top 0.254: U$3.P$16 26.32,47.98 19.05,55.24 19.05,59.62 U2.12
BUTTON_WEST_CLOSE-IN_EXT
  Top 1.016: X4.3 72.71,66.26 R47.2
BUTTON_WEST_CLOSE_IN_5V  (via drill 0.35)
  Top 0.254: R47.1 74.61,63.18 v74.3,62.87 | R15.2 41.27,45.09 39.03,47.33 U$3.P$4 34.81,47.33 v34.59,47.55
  Top 1.016: R47.1 C43.1
  Bottom 0.254: v74.3,62.87 68.76,57.33 40.18,57.33 34.42,51.56 34.42,47.88 34.59,47.7 v34.59,47.55
DIR-5V_TR
  Top 0.254: R22.1 17.78,14.22 20.95,11.05 30.59,11.05
  Top 0.305: 30.59,11.05 T2.1
DIR_5V_OUT
  Top 0.61: T2.2 30.65,3.81 X10.2
EN-5V_TR
  Top 0.254: 15.41,13.59 T1.1
  Top 0.406: R12.1 15.41,13.59
EN_5V_OUT
  Top 0.61: X2.2 15.41,3.94 T1.2
ETH_CS
  Top 0.254: U1.32 63.38,41.8 64.14,42.55 64.14,44.45 62.98,45.61 62.91,45.61 62.5,46.01 62.5,46.08 60.33,48.26 50.16,48.26 47.4,45.49 47.4,38.57 45.89,37.06 32.61,37.06 30.48,34.92 30.48,33.66 29.84,33.02 25.48,33.02 U2.29
ETH_RESET  (via drill 0.35)
  Top 0.254: R30.1 56.29,34.7 56.39,34.8 v56.52,34.92 59.69,34.92 62.23,37.47 62.87,37.47 63.29,37.89 U1.37
  Bottom 0.254: v56.52,34.92 53.98,32.38 44.45,32.38 43.18,33.66 43.18,34.92 42.55,35.56 17.86,35.56 U2.26
GND  (via drill 0.3, 0.35, 0.5 pad 1.27)
  other vias: 10.79,26.04 18.41,24.77 43.81,8.89 24.77,12.06 10.16,22.23 10.16,20.95 67.31,48.26 71.37,43.43 66.04,42.55 67.31,43.81 67.31,40.64 63.5,43.18 63.5,40.01 77.47,44.45 71.75,36.2 26.04,43.18 41.27,27.3 74.3,24.77 13.97,20.95 8.89,46.35 78.11,36.2 36.83,43.81 81.92,31.11 83.82,40.64 53.34,46.35 71.75,40.64 16.51,29.84 76.83,12.7 57.78,38.73 34.92,55.24 10.16,19.68 37.21,51.82 62.87,29.84 96.9,45.72 91.19,40.01
  pour Bottom (isolate 0.122, rank 2, no thermals): 0,0 0,76.2 111.12,76.2 111.12,0
  pour Top (isolate 0.122, rank 2, no thermals): 0,0 0,76.2 111.12,76.2 111.12,0
HOME_SHUTTER_CLOSED
  Top 0.254: U$3.P$17 17.48,47.33 16.51,46.35 16.51,38.1 14.61,36.2 10.16,36.2 8.96,35 U2.23
HOME_SHUTTER_CLOSED-IN_EXT
  Top 1.016: X1.2 63.82,67.38 R50.2
HOME_SHUTTER_CLOSED_IN_5V  (via drill 0.35)
  Top 0.254: R18.2 41.78,43.05 38.16,46.67 U$3.P$3 34.22,46.67 v33.66,47.24 | R50.1 65.62,63.08 v65.41,62.87
  Top 1.016: C46.1 R50.1
  Bottom 0.254: v65.41,62.87 60.33,57.78 40.01,57.78 33.66,51.44 33.66,48.13 v33.66,47.24
LINK_ACK  (via drill 0.35)
  Top 0.254: U1.25 61.38,45.3 v60.21,46.47
  Bottom 0.254: v60.21,46.47 63.91,50.16 83.82,50.16 88.65,54.99 X9.10
M_DIR
  Top 0.254: U2.24 11.51,32.31 13.34,30.48 13.34,25.4 12.38,24.45 U$1.P$3
M_DIR_5V
  Top 0.254: U$1.P$17 16.18,23.8 15.88,23.5 15.88,19.05 17.14,17.78
  Top 0.305: R22.2 17.78,17.14 17.14,17.78
M_EN
  Top 0.254: U2.15 11.51,39.19 7.87,35.56 7.87,28.1 10.88,25.09 U$1.P$2
M_EN_5V
  Top 0.254: U$1.P$18 15.68,24.45 15.24,24 15.24,14.61
  Top 0.305: R12.2 15.24,14.61
M_STEP
  Top 0.254: U2.7 31.82,60.25 30.48,61.59 11.43,61.59 10.16,60.33 10.16,39.88 5.21,34.92 5.21,27.81 9.22,23.8 U$1.P$4
M_STEP_5V
  Top 0.254: U$1.P$16 20.67,23.14 21.59,22.23 R41.2
N$2
  Top 0.61: R8.1 R7.2
N$3
  Top 0.61: R10.1 R8.2
N$5
  Top 0.61: R7.1 R2.2
N$7
  Top 0.254: R27.2 80.24,37.47 | 80.24,37.47 R26.2 C22.1 | X9.6 98.42,48.9 98.42,46.35 89.42,37.35 85.11,37.35 84.99,37.47 80.24,37.47
N$8
  Top 0.305: X9.9 93.38,56.48 93.38,48.33 92.71,47.66 91.89,47.66 91.85,47.62 88.42,47.62 R29.1
N$10  (via drill 0.35)
  Top 0.305: R28.1 88.78,33.54 v92.08,36.83
  Bottom 0.305: v92.08,36.83 92.33,37.08 X9.12
N$11
  Top 0.305: C15.2 88.57,38.41 97.16,46.99 X9.7
N$12
  Top 0.305: C21.2 89.03,35.69 99.69,46.35 X9.8
N$13
  Top 0.305: R23.1 90.84,42.58 95.89,47.62 95.89,53.34 96.52,53.98 X9.3
  Top 0.406: R23.1 C10.1
N$22
  Top 0.254: R31.1 58.42,33.91 58.93,34.42 59.82,34.42 62.23,36.83 62.87,36.83 63.79,37.76 U1.38
N$23
  Top 0.254: R32.1 60.52,34.48 60.96,34.92 62.23,36.2 62.87,36.2 64.29,37.62 U1.39
N$24
  Top 0.254: R33.1 62.61,35.31 64.79,37.48 U1.40
N$25
  Top 0.254: R34.1 64.71,36.77 65.29,37.35 U1.41
N$26
  Top 0.254: R35.1 66.8,36.07 65.79,37.08 U1.42
N$27
  Top 0.254: R36.1 68.9,34.61 66.29,37.22 U1.43
N$28
  Top 0.254: R37.1 67.47,36.83 67.31,36.83 66.79,37.35 U1.44
N$29
  Top 0.254: R38.1 71.47,34.92 69.95,34.92 67.29,37.58 U1.45
N$31
  Top 0.254: U1.20 65.29,47.51 66.83,49.05 C19.2
N$33
  Top 0.254: U1.22 64.29,48.1 62.71,49.69 C18.2
N$34
  Top 0.254: U1.10 71.91,44.3 72.6,43.6 R39.1
N$35
  Top 0.254: U1.23 63.79,47.97 62.87,48.9 61.59,48.9 60.64,49.85 R40.2
RG-11
  Top 0.254: U$3.P$13 28.82,49.92 26.75,51.99 U2.9
RG-11-IN_5V  (via drill 0.35)
  Top 0.254: R4.1 39.75,51.18 37.84,49.27 U$3.P$7 33.27,49.27 v33.02,49.53 | R5.1 47.84,63.08 v47.62,62.87
  Top 1.016: R5.1 C1.1
  Bottom 0.254: v47.62,62.87 46.35,61.59 36.83,61.59 35.69,60.45 35.69,58.8 32.38,55.5 32.38,50.16 v33.02,49.53
RG-11-IN_EXT
  Top 1.016: X5.2 46.04,69.59 R5.2
RX2
  Top 0.254: U2.27 19.12,34.22 22.86,30.48 27.3,30.48 29.84,27.94 JP1.2
RXN  (via drill 0.35)
  Top 0.254: C21.1 85.86,35.66 R26.1 | U1.5 72.28,41.8 v72.39,41.91
  Top 0.305: R26.1 82.14,35.97 v81.28,36.83
  Bottom 0.254: v81.28,36.83 81.28,39.15 78.52,41.91 v72.39,41.91
RXP  (via drill 0.35)
  Top 0.254: R27.1 82.55,38.82 | 82.55,38.82 85.47,38.82 C15.1 | U1.6 71.5,42.3 v71.72,42.51 | v71.72,42.51 71.75,42.55 v71.72,42.51 | v81.27,40.02 81.31,40.06 82.55,38.82
  Bottom 0.254: v71.72,42.51 78.77,42.51 v81.27,40.02 | v81.27,40.02 81.28,40.01 v81.27,40.02
SCL
  Top 0.254: R1.1 36.62,28.57 IC2.6 41.27,28.57 41.98,29.29 U2.36
SCLK  (via drill 0.35)
  Top 0.254: v60.33,41.27 60.34,41.3 U1.33 | U2.30 30.55,38.1 45.09,38.1 46.35,39.37 v46.35,41.27
  Bottom 0.254: v46.35,41.27 v60.33,41.27
SDA  (via drill 0.35)
  Top 0.254: R3.1 34.04,28.96 34.92,29.84 IC2.5 v41.27,29.84
  Bottom 0.254: v41.27,29.84 40.56,30.55 38.1,30.55 U2.33
SDI
  Top 0.254: U1.34 64.29,40.8 64.77,41.27 64.77,44.45 63.2,46.02 63.07,46.02 62.91,46.18 62.91,46.31 60.33,48.9 58.42,48.9 49.53,48.9 46.99,46.35 46.99,38.73 45.72,37.47 31.75,37.47 29.29,35 U2.31
SDO  (via drill 0.35)
  Top 0.254: U1.35 60.62,40.3 59.69,39.37 59.69,36.2 59.05,35.56 v54.61,35.56
  Bottom 0.254: v54.61,35.56 52.07,33.02 45.72,33.02 44.52,34.22 U2.37
SHUTTER_OPENED
  Top 0.254: U$3.P$12 29.43,50.58 28.57,51.44 28.57,58.98 U2.8
SHUTTER_OPENED-IN_EXT
  Top 1.016: X3.2 54.93,68.48 R48.2
SHUTTER_OPENED_IN_5V  (via drill 0.35)
  Top 0.254: R17.2 39.24,53.21 38.73,52.7 38.73,50.8 37.86,49.92 U$3.P$8 33.51,49.92 v33.02,50.42 | R48.1 56.73,63.08 v56.52,62.87
  Top 1.016: R48.1 C44.1
  Bottom 0.254: v56.52,62.87 54.61,60.96 38.99,60.96 38.2,60.17 38.2,56.9 33.02,51.72 v33.02,50.42
SPARE1
  Top 0.254: U$3.P$18 31.43,46.67 31.75,46.99 31.75,50.16 36.91,55.32 U2.5
SPARE1-IN_EXT
  Top 1.016: X8.1 37.15,69.89 R45.2
SPARE1_IN_5V  (via drill 0.35)
  Top 0.254: R21.2 42.29,41.02 37.29,46.02 U$3.P$2 34.59,46.02 v34.29,45.72 | v31.75,62.87 38.1,62.87 38.95,63.72 R45.1
  Top 1.016: C41.1 R45.1
  Bottom 0.254: v31.75,62.87 31.59,62.87 31.16,62.44 30.73,62.01 30.73,49.28 v34.29,45.72
SPARE2
  Top 0.254: U$3.P$14 28.2,49.27 24.2,53.27 U2.10
SPARE2-IN_EXT
  Top 1.016: R49.2 28.26,66.81 X8.2
SPARE2_IN_5V  (via drill 0.35)
  Top 0.254: R9.2 41.15,49.15 40.62,48.62 U$3.P$6 32.66,48.62 v32.38,48.9 | 33.02,64.56 v33.02,63.5
  Top 0.406: C45.1 33.02,64.56
  Top 1.016: R49.1 C45.1
  Bottom 0.254: v33.02,63.5 33.02,63.02 33.02,58.42 31.75,57.15 31.75,49.53 v32.38,48.9
SPARE_OUT1
  Top 0.254: U2.25 14.04,24.2 12.95,23.11 11.7,23.11 U$1.P$5
SPARE_OUT1_5V  (via drill 0.35)
  Top 0.254: U$1.P$15 16.78,22.5 16.51,22.23 16.51,19.43 19.18,16.76 19.18,14.1 20.57,12.7 v35.56,12.7 | v40.01,12.7 45.62,12.7 46.43,11.89 51.56,11.89 52.92,10.53 64.78,10.53 65.85,9.46 X7.3
  Bottom 0.254: v35.56,12.7 v40.01,12.7
SPARE_OUT2  (via drill 0.35)
  Top 0.254: U2.13 16.59,53.41 14.61,51.44 v14.61,38.1 | v15.24,35.56 15.24,31.75 14.61,31.11 14.61,24.13 12.97,22.5 U$1.P$6
  Bottom 0.254: v14.61,38.1 15.24,37.47 v15.24,35.56
SPARE_OUT2_5V  (via drill 0.35)
  Top 0.254: U$1.P$14 19.43,21.84 19.68,21.59 19.68,14.61 20.95,13.34 v34.29,13.34 | v38.1,13.34 40.01,11.43 51.41,11.43 52.75,10.1 60.13,10.1 60.85,9.38 X7.2
  Bottom 0.254: v34.29,13.34 v38.1,13.34
STEP-5V_TR
  Top 0.254: T3.1 39.69,10.47 36.2,13.97 22.23,13.97 21.59,14.61
  Top 0.305: R41.1 21.59,14.61
STEP_5V_OUT
  Top 0.406: T3.2 45.85,8.53
  Top 0.61: 45.85,8.53 X6.2
TX2
  Top 0.254: U2.28 21.66,32.31 22.86,31.11 27.3,31.11 32.38,26.04 32.38,24.77 JP1.1
TXN  (via drill 0.35)
  Top 0.254: R25.1 82.06,42.6 81.62,42.16 81.62,41.61 80.65,40.64 79.12,40.64 77.68,39.2 71.28,39.2 70.69,39.8 U1.1
  Top 0.305: R25.1 83.24,42.6 v83.82,43.18
  Bottom 0.305: v83.82,43.18 84.45,43.81 84.45,48.26 85.09,48.9 88.9,52.7 94.35,52.7 96.89,55.24 X9.2
TXP  (via drill 0.35)
  Top 0.254: U1.2 71.08,40.3 71.77,39.61 77.41,39.61 79.08,41.27 80.71,41.27 81.21,41.77 81.21,44.19 R24.1
  Top 0.305: R24.1 83.22,45.12 v83.82,45.72
  Bottom 0.305: v83.82,45.72 83.82,48.9 84.45,49.53 88.4,53.47 94.11,53.47 X9.1
VCC  (via drill 0.35, 0.5 pad 1.2, 0.55 pad 1.2)
  Top 0.61: T3.3 48.9,9.53 50.85,7.57 X6.3 | X10.3 35.87,9.22 34.92,10.16 T2.3 | X2.3 20.75,9.09 19.68,10.16 T1.3
  Top 0.813: v18.41,26.67 17.61,27.47 C6.1
  Top 1.27: R20.2 R17.1 R4.2 R9.1 R16.1 R15.1 R18.1 R21.1 44.66,39.54 v44.7,39.5 | C23.1 75.56,19.27 79.59,19.27 81.28,20.95 IC1.4 IC1.2 | C23.1 74.74,18.44 IC8.3 72.16,15.27 70.23,13.34 v47.5,13.34 47.5,28.45 49.53,30.48 v49.53,34.92 | C28.1 C23.1
  Bottom 1.27: X2.3 20.75,6.55 22.66,6.55 | X10.3 35.87,5.41 34.72,6.55 | X6.3 50.85,5.03 49.33,6.55 48.01,6.55 47.5,6.55 | 22.66,6.55 34.72,6.55 | 34.72,6.55 41.27,6.55 47.5,6.55 | v18.41,26.67 22.66,22.43 22.66,6.55 | 47.5,6.55 v47.5,13.34 | U2.19 1.34,43.74 5.71,39.37 44.58,39.37 | 44.58,39.37 v44.7,39.5 | v49.53,34.92 45.09,39.37 44.58,39.37
  pour Top (no thermals): 16.89,27.94 18.8,27.94 18.8,25.65 16.89,25.65
VPIN  (via drill 0.35)
  Top 0.305: R6.2 53.12,11.01 51.82,12.32 46.74,12.32 46.23,12.83 46.23,29.08 48.26,31.11 v48.26,45.09 | v48.26,49.53 48.26,55.88 45.72,58.42 43.18,58.42 41.98,59.62 U2.3
  Top 0.61: R2.1 R6.2
  Bottom 0.305: v48.26,45.09 v48.26,49.53
XI
  Top 0.254: U1.30 60.58,42.8 25MHZ.3

### Text on the board
tPlace: SPARE1 | SPARE2 | GND | RG-11 | 12V | Opened | GND | Home | GND | West | East | GND | AT_PARK_PIN_EXT | GND | Dome Rotator / RoR | GND | RX | TX | GND | GND | EN | +5V | GND | DIR | +5V | GND | STEP | +5V | +12V
bPlace: SPARE1 | SPARE2 | GND | RG-11 | 12V | Opened | GND | Home | GND | West | East | GND | AT_PARK_PIN_EXT | GND | EN | +5V | DIR | +5V | STEP | +5V